# EAGLE design PowerSocket2 (EAGLE 8.2.1)
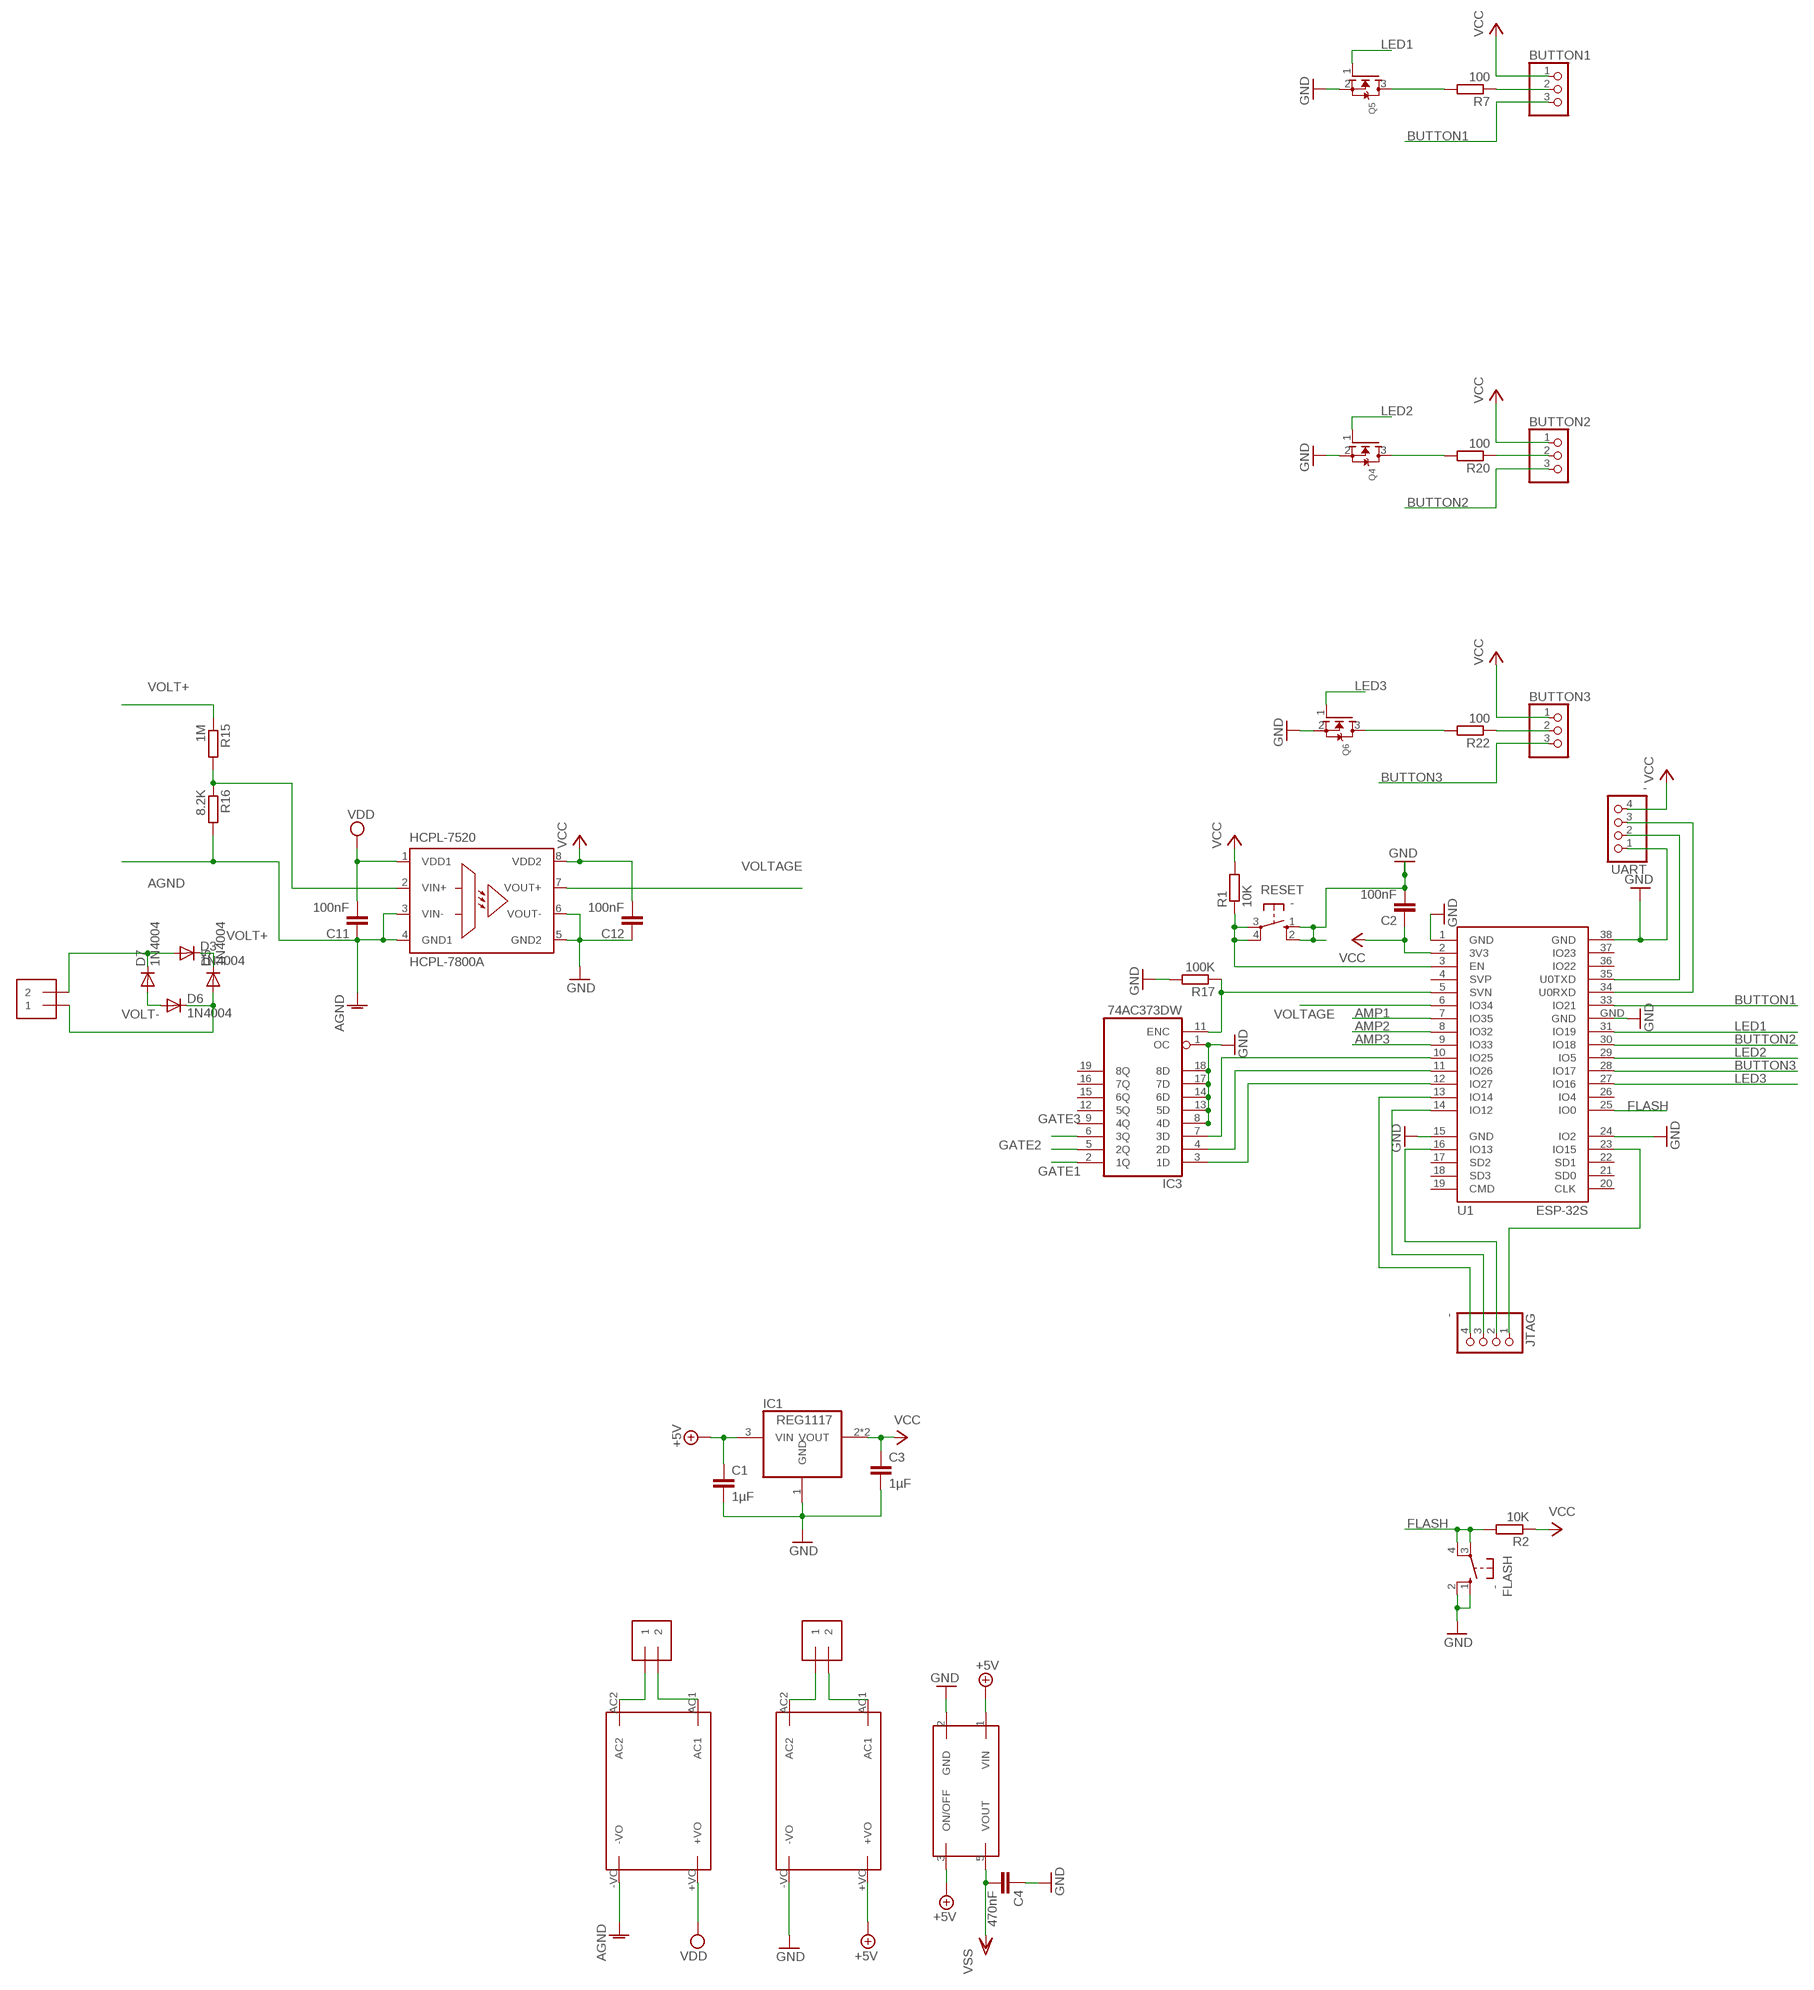
[diagram p0: schematic, sheet 1, part 1 of 2]
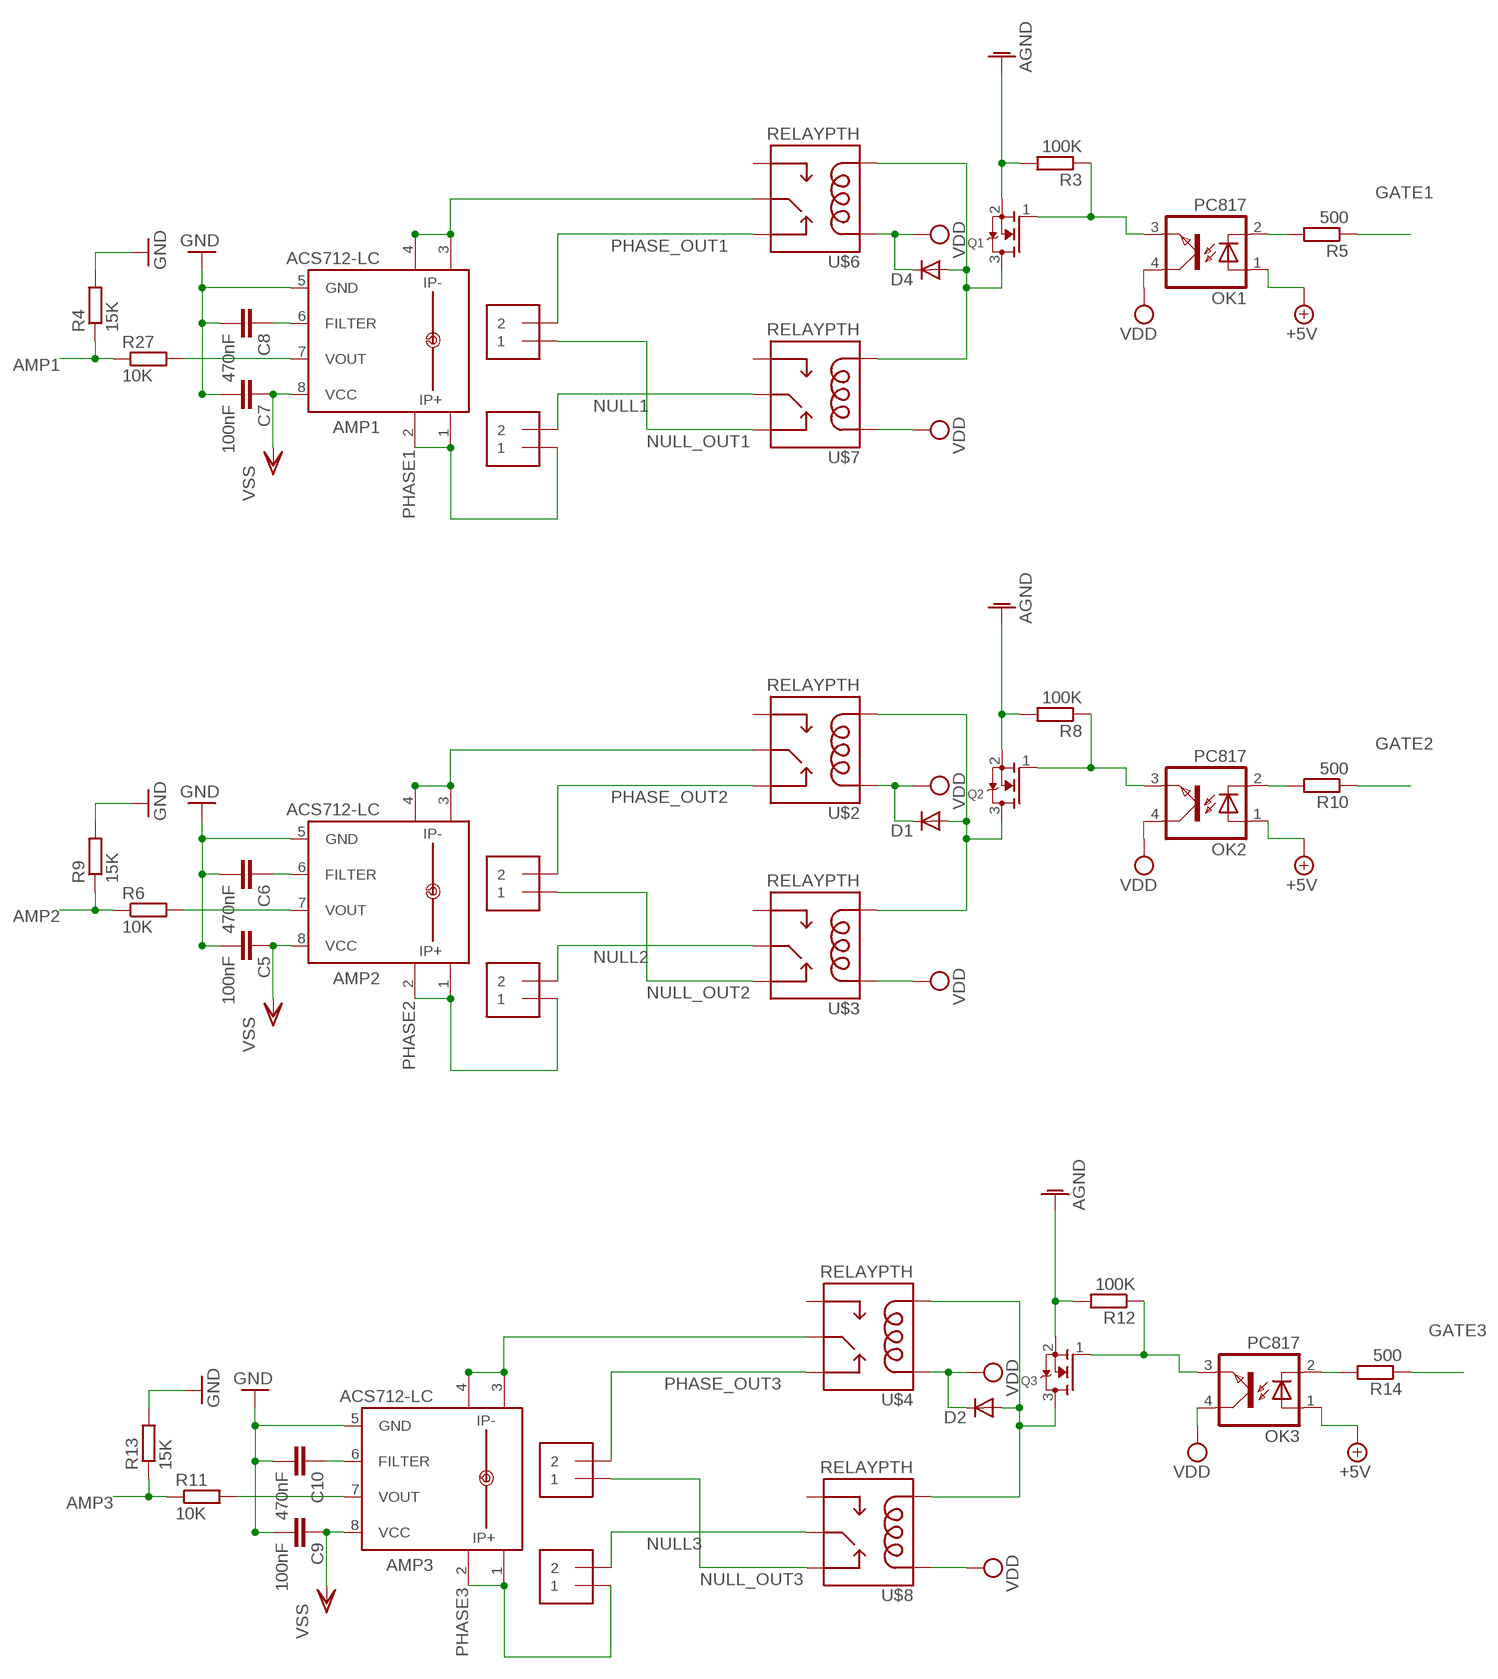
[diagram p1: schematic, sheet 1, part 2 of 2]

## Parts
4.5V_REG  S1112  [SOT23-5]
AMP1  ACS712-LC  [SOIC8]
AMP2  ACS712-LC  [SOIC8]
AMP3  ACS712-LC  [SOIC8]
BUTTON1  PINHD-1X3  [1X03]
BUTTON2  PINHD-1X3  [1X03]
BUTTON3  PINHD-1X3  [1X03]
C1  1µF  C-EU025-024X044  [C025-024X044]
C2  100nF  C-EUC1206  [C1206]
C3  1µF  C-EU025-024X044  [C025-024X044]
C4  470nF  C-EUC0805  [C0805]
C5  100nF  C-EUC0805  [C0805]
C6  470nF  C-EUC0805  [C0805]
C7  100nF  C-EUC0805  [C0805]
C8  470nF  C-EUC0805  [C0805]
C9  100nF  C-EUC0805  [C0805]
C10  470nF  C-EUC0805  [C0805]
C11  100nF  C-EUC1206  [C1206]
C12  100nF  C-EUC1206  [C1206]
D1  DIODE-DO-214AC  [DO-214AC]
D2  DIODE-DO-214AC  [DO-214AC]
D3  1N4004  [DO41-10]
D4  DIODE-DO-214AC  [DO-214AC]
D5  1N4004  [DO41-10]
D6  1N4004  [DO41-10]
D7  1N4004  [DO41-10]
FLASH  -  10-XX  [B3F-10XX]
HCPL-7520  HCPL-7800A  [DIP8]
IC1  REG1117  [SOT223]
IC3  74AC373DW  [SO20W]
J1  1X2-3.5MM  [1X2-3.5MM]
J2  1X2-3.5MM  [1X2-3.5MM]
J3  1X2-3.5MM  [1X2-3.5MM]
J4  1X2-3.5MM  [1X2-3.5MM]
J5  1X2-3.5MM  [1X2-3.5MM]
J6  1X2-3.5MM  [1X2-3.5MM]
J7  1X2-3.5MM  [1X2-3.5MM]
J8  1X2-3.5MM  [1X2-3.5MM]
J9  1X2-3.5MM  [1X2-3.5MM]
JTAG  -  PINHD-1X4  [1X04]
OK1  PC817  [DIL04]
OK2  PC817  [DIL04]
OK3  PC817  [DIL04]
Q1  MOSFET-NREFLOW  [SOT23]
Q2  MOSFET-NREFLOW  [SOT23]
Q3  MOSFET-NREFLOW  [SOT23]
Q4  MOSFET-NREFLOW  [SOT23]
Q5  MOSFET-NREFLOW  [SOT23]
Q6  MOSFET-NREFLOW  [SOT23]
R1  10K  R-EU_R0805  [R0805]
R2  10K  R-EU_R0805  [R0805]
R3  100K  R-EU_R0805  [R0805]
R4  15K  R-EU_R0805  [R0805]
R5  500  R-EU_R0805  [R0805]
R6  10K  R-EU_R0805  [R0805]
R7  100  R-EU_R0805  [R0805]
R8  100K  R-EU_R0805  [R0805]
R9  15K  R-EU_R0805  [R0805]
R10  500  R-EU_R0805  [R0805]
R11  10K  R-EU_R0805  [R0805]
R12  100K  R-EU_R0805  [R0805]
R13  15K  R-EU_R0805  [R0805]
R14  500  R-EU_R0805  [R0805]
R15  1M  R-EU_0207/10  [0207/10]
R16  8.2K  R-EU_0207/10  [0207/10]
R17  100K  R-EU_R0805  [R0805]
R20  100  R-EU_R0805  [R0805]
R22  100  R-EU_R0805  [R0805]
R27  10K  R-EU_R0805  [R0805]
RESET  -  10-XX  [B3F-10XX]
U1  ESP-32S  [ESP-32S]
U$1  HLK-PM03  [HLK-PM03]
U$2  RELAYPTH  [SRD-05VDC-SL-C]
U$3  RELAYPTH  [SRD-05VDC-SL-C]
U$4  RELAYPTH  [SRD-05VDC-SL-C]
U$5  HLK-PM03  [HLK-PM03]
U$6  RELAYPTH  [SRD-05VDC-SL-C]
U$7  RELAYPTH  [SRD-05VDC-SL-C]
U$8  RELAYPTH  [SRD-05VDC-SL-C]
UART  -  PINHD-1X4  [1X04]

## Nets
+5V: 4.5V_REG.1(VIN) 4.5V_REG.3(ON/OFF) C1.1 IC1.3(VIN) OK1.1(A) OK2.1(A) OK3.1(A) U$1.+VO
AGND: C11.1 HCPL-7520.3(VIN-) HCPL-7520.4(GND1) Q1.2(S) Q2.2(S) Q3.2(S) R3.2 R8.2 R12.2 R16.2 U$5.-VO
AMP1: R4.1 R27.1 U1.7(IO35)
AMP2: R6.1 R9.1 U1.8(IO32)
AMP3: R11.1 R13.1 U1.9(IO33)
BUTTON1: BUTTON1.3 U1.33(IO21)
BUTTON2: BUTTON2.3 U1.30(IO18)
BUTTON3: BUTTON3.3 U1.28(IO17)
FLASH: FLASH.3(P) FLASH.4(P1) R2.2 U1.25(IO0)
GATE: OK1.3(EMIT) Q1.1(G) R3.1
GATE1: IC3.2(1Q) R5.1
GATE2: IC3.5(2Q) R10.1
GATE3: IC3.6(3Q) R14.1
GATE4: OK2.3(EMIT) Q2.1(G) R8.1
GATE5: OK3.3(EMIT) Q3.1(G) R12.1
GND: 4.5V_REG.2(GND) AMP1.5(GND) AMP2.5(GND) AMP3.5(GND) C1.2 C2.2 C3.2 C4.1 C5.2 C6.2 C7.2 C8.2 C9.2 C10.2 C12.1 FLASH.1(S) FLASH.2(S1) HCPL-7520.5(GND2) HCPL-7520.6(VOUT-) IC1.1(GND) IC3.1(OC) IC3.8(4D) IC3.13(5D) IC3.14(6D) IC3.17(7D) IC3.18(8D) Q4.2(S) Q5.2(S) Q6.2(S) R4.2 R9.2 R13.2 R17.2 RESET.1(S) RESET.2(S1) U1.1(GND) U1.15(GND) U1.24(IO2) U1.38(GND) U1.GND U$1.-VO UART.1
LED1: Q5.1(G) U1.31(IO19)
LED1_SWITCHED: Q5.3(D) R7.2
LED2: Q4.1(G) U1.29(IO5)
LED2_SWITCHED: Q4.3(D) R20.2
LED3: Q6.1(G) U1.27(IO16)
LED3_SWITCHED: Q6.3(D) R22.2
N$1: D4.A Q1.3(D) U$6.COIL0 U$7.COIL0
N$2: JTAG.1 U1.23(IO15)
N$3: JTAG.2 U1.16(IO13)
N$4: JTAG.3 U1.14(IO12)
N$5: JTAG.4 U1.13(IO14)
N$6: J4.2 U$5.AC1
N$7: BUTTON2.2 R20.1
N$8: J4.1 U$5.AC2
N$9: BUTTON1.2 R7.1
N$10: OK1.2(C) R5.2
N$11: BUTTON3.2 R22.1
N$12: AMP2.6(FILTER) C6.1
N$13: AMP2.7(VOUT) R6.2
N$14: D1.A Q2.3(D) U$2.COIL0 U$3.COIL0
N$17: OK2.2(C) R10.2
N$19: AMP2.3(IP-) AMP2.4(IP-1) U$2.SWCOMMON
N$24: AMP1.6(FILTER) C8.1
N$26: AMP1.3(IP-) AMP1.4(IP-1) U$6.SWCOMMON
N$27: AMP3.6(FILTER) C10.1
N$28: AMP3.7(VOUT) R11.2
N$29: D2.A Q3.3(D) U$4.COIL0 U$8.COIL0
N$30: OK3.2(C) R14.2
N$31: AMP3.3(IP-) AMP3.4(IP-1) U$4.SWCOMMON
N$32: IC3.11(ENC) R17.1 U1.5(SVN)
N$33: IC3.3(1D) U1.12(IO27)
N$34: IC3.4(2D) U1.11(IO26)
N$35: IC3.7(3D) U1.10(IO25)
N$37: D3.A D7.C J9.2
N$38: D5.A D6.C J9.1
N$39: HCPL-7520.2(VIN+) R15.2 R16.1
N$41: AMP1.7(VOUT) R27.2
N$66: R1.1 RESET.3(P) RESET.4(P1) U1.3(EN)
N$70: U1.35(U0TXD) UART.2
N$77: U1.34(U0RXD) UART.3
NULL1: J2.2 U$7.SWCOMMON
NULL2: J6.2 U$3.SWCOMMON
NULL3: J8.2 U$8.SWCOMMON
NULL_MIC: J3.1 U$1.AC2
NULL_OUT1: J1.1 U$7.SWCLOSED(SWCLOSE)
NULL_OUT2: J5.1 U$3.SWCLOSED(SWCLOSE)
NULL_OUT3: J7.1 U$8.SWCLOSED(SWCLOSE)
PHASE1: AMP1.1(IP+) AMP1.2(IP+1) J2.1
PHASE2: AMP2.1(IP+) AMP2.2(IP+1) J6.1
PHASE3: AMP3.1(IP+) AMP3.2(IP+1) J8.1
PHASE_MIC: J3.2 U$1.AC1
PHASE_OUT1: J1.2 U$6.SWCLOSED(SWCLOSE)
PHASE_OUT2: J5.2 U$2.SWCLOSED(SWCLOSE)
PHASE_OUT3: J7.2 U$4.SWCLOSED(SWCLOSE)
VCC: BUTTON1.1 BUTTON2.1 BUTTON3.1 C2.1 C3.1 C12.2 HCPL-7520.8(VDD2) IC1.2(VOUT) IC1.4(VOUT) R1.2 R2.1 U1.2(3V3) UART.4
VDD: C11.2 D1.C D2.C D4.C HCPL-7520.1(VDD1) OK1.4(COL) OK2.4(COL) OK3.4(COL) U$2.COIL1 U$3.COIL1 U$4.COIL1 U$5.+VO U$6.COIL1 U$7.COIL1 U$8.COIL1
VOLT+: D3.C D5.C R15.1
VOLT-: D6.A D7.A
VOLTAGE: HCPL-7520.7(VOUT+) U1.6(IO34)
VSS: 4.5V_REG.5(VOUT) AMP1.8(VCC) AMP2.8(VCC) AMP3.8(VCC) C4.2 C5.1 C7.1 C9.1
Unconnected: IC3.9(4Q) IC3.12(5Q) IC3.15(6Q) IC3.16(7Q) IC3.19(8Q) U1.4(SVP) U1.17(SD2) U1.18(SD3) U1.19(CMD) U1.20(CLK) U1.21(SD0) U1.22(SD1) U1.26(IO4) U1.36(IO22) U1.37(IO23) U$2.SWOPEN U$3.SWOPEN U$4.SWOPEN U$6.SWOPEN U$7.SWOPEN U$8.SWOPEN

## Power pins joined to a net without a drawn wire
GND: IC3.10(GND)
VCC: IC3.20(VCC)

## Library data of the parts
4.5V_REG = PowerSocket:S1112
AMP1-AMP3 = allegro-2:ACS712-LC
BUTTON1-BUTTON3 = pinhead:PINHD-1X3: PIN HEADER
C1-C12 = rcl:C-EU: CAPACITOR, European symbol
D1 D2 D4 = diode:DIODE-: DIODE
D3 D5-D7 = diode@1:1N4004: DIODE general purpose rectifier, 1 A
FLASH RESET = switch-omron:10-XX: OMRON SWITCH; MPN: B3F-1000; OC_FARNELL: 176432; OC_NEWARK: 36M3542
HCPL-7520 = avago:HCPL-7800: Isolation Amplifer Source: http://www.avagotech.com/docs/AV02-0410EN; MF: AGILENT TECHNOLOGIES; MPN: HCPL-7800A-000E; OC_FARNELL: 8550026; OC_NEWARK: 88H7847
IC1 = burr-brown:REG1117: 800mA and 1A Low Dropout (LDO) Positive Regulator 1.8V, 2.5V, 2.85V, 3.3V, 5V, and Adj; MPN: REG1117; OC_FARNELL: 1097566; OC_NEWARK: 14P6981
IC3 = 74xx-eu:74*373: Octal D type transparent LATCH, edge triggered
J1-J9 = adafruit:1X2: 3.5mm Terminal block http://www.ladyada.net/library/pcb/eaglelibrary.html
JTAG UART = pinhead:PINHD-1X4: PIN HEADER
OK1-OK3 = optocoupler:PC817: SHARP OPTO COUPLER; MPN: PC817X4J000F; OC_FARNELL: 9707727; OC_NEWARK: 97K7059
Q1-Q6 = adafruit:MOSFET-N: N-Channel Mosfet 2N7002E - 60V 260mA SOT23 [Digikey: 2N7002ET1GOSTR-ND] - REEL BSH103 - 30V 850mA SOT23 [Digikey: 568-5013-1-ND]
R1-R14 R17 R20 R22 R27 = rcl:R-EU_: RESISTOR, European symbol
R15 R16 = resistor:R-EU_: RESISTOR, European symbol
U1 = esp32:ESP-32S: Ai-Thinker ESP-32S
U$1 U$5 = PowerSocket:HLK-PM03
U$2-U$4 U$6-U$8 = SRD-05VDC-SL-C:RELAY: SPDT relay (COM-00101)

## Board
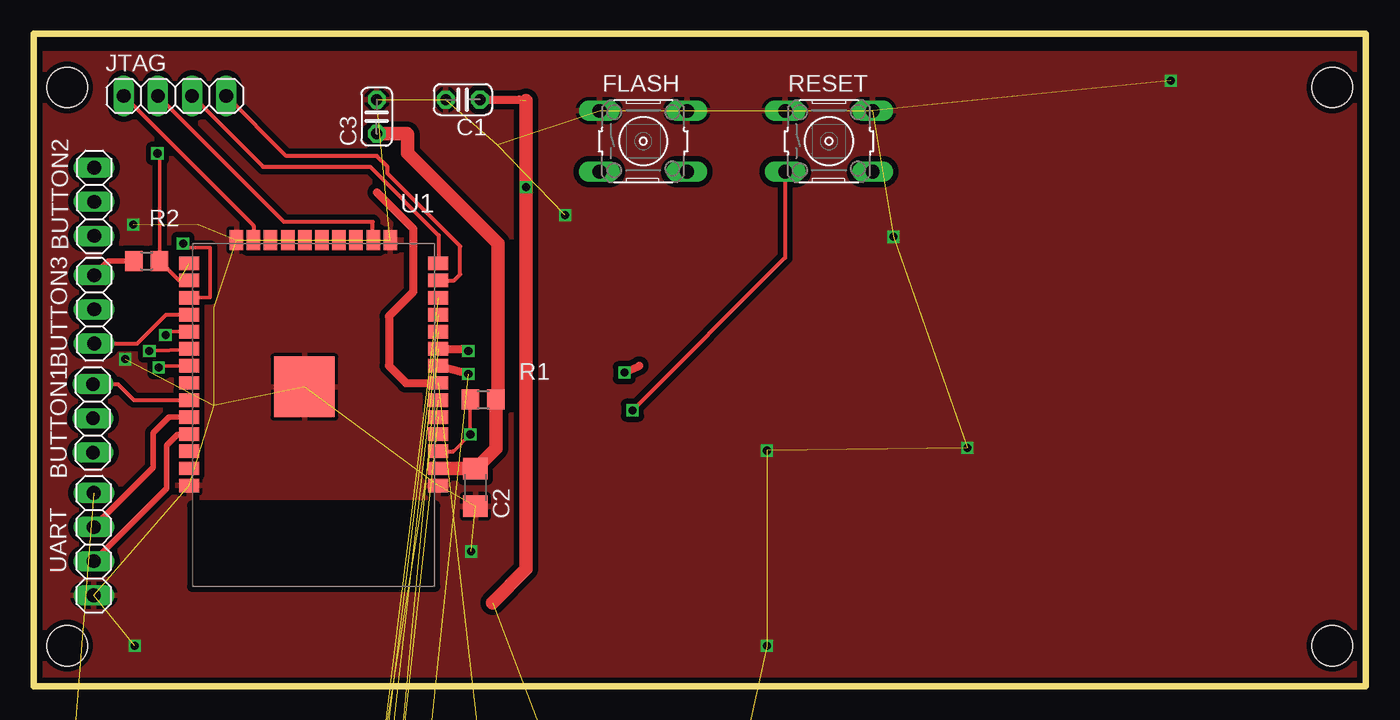
[diagram p2: board, top side]
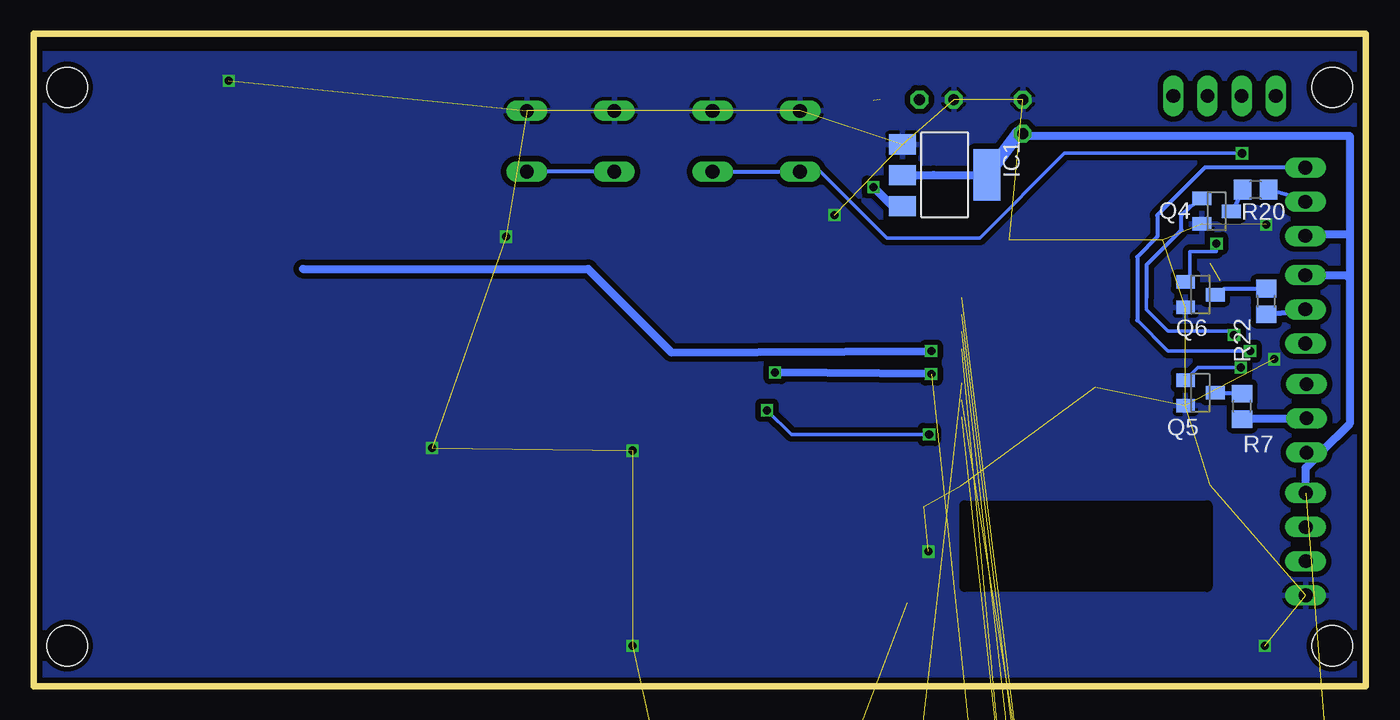
[diagram p3: board, bottom side, seen from below]

Size 99 x 48.5 mm. Coordinates in mm from the lower left corner, seen from the top.
Outline: 0,0 99,0 99,48.5 0,48.5 0,0
Copper layers (1*16): Top 0.035mm / dielectric 1.5mm / Bottom 0.035mm
Design rules "dirt_cheap_dirty_boards.v1": minimum track width 5mil, minimum drill 12mil, track to track 5mil, track to pad 5mil, pad to pad 5mil, via to via 5mil, smd to smd 0mil, copper to edge 10mil, drill to drill 10mil, minimum pad ring 10mil, minimum via ring 6mil, stop-mask expansion 2mil, vias tented up to drill 25mil, thermal gap 10mil
Holes 3 mm at 2.5,3 96.5,3 96.5,44.5 2.5,44.5

### Footprints (pad centres in the part's own frame; a part is rotated, then mirrored left to right if it is on the bottom)
SOT23-5 = smd 0.5 x 1: 1 -0.95,-1.2; 2 0,-1.2; 3 0.95,-1.2; 4 0.95,1.2; 5 -0.95,1.2
SOIC8 = smd 0.6 x 2.2: 1 -1.905,-2.6; 2 -0.635,-2.6; 3 0.635,-2.6; 4 1.905,-2.6; 5 1.905,2.6; 6 0.635,2.6; 7 -0.635,2.6; 8 -1.905,2.6
1X03 = drill 1.016 long: 1 -2.54,0; 2 0,0; 3 2.54,0
C025-024X044 = drill 0.813 octagon: 1 -1.27,0; 2 1.27,0
C1206 = smd 1.6 x 1.8: 1 -1.4,0; 2 1.4,0
C0805 = smd 1.3 x 1.5: 1 -0.95,0; 2 0.95,0
DO-214AC = smd 1.8 x 2.4: A 2.025,0; C -2.025,0
DO41-10 = drill 1.118: A 5.08,0; C -5.08,0
B3F-10XX = drill 1.016 long: 1 -3.251,2.261; 2 3.251,2.261; 3 -3.251,-2.261; 4 3.251,-2.261
DIP8 = smd 1.16 x 2: 1 -3.81,-4.45; 4 3.81,-4.45; 5 3.81,4.45; 8 -3.81,4.45 | smd 1.27 x 2: 2 -1.27,-4.45; 3 1.27,-4.45; 6 1.27,4.45; 7 -1.27,4.45
SOT223 = smd 1.499 x 2.007: 1 -2.261,-3.15; 2 0.025,-3.15; 3 2.311,-3.15 | smd 3.81 x 2.007: 4 0,3.15
SO20W = smd 0.66 x 2.032: 1 -5.715,-5.029; 2 -4.445,-5.029; 3 -3.175,-5.029; 4 -1.905,-5.029; 5 -0.635,-5.029; 6 0.635,-5.029; 7 1.905,-5.029; 8 3.175,-5.029; 9 4.445,-5.029; 10 5.715,-5.029; 11 5.715,5.029; 12 4.445,5.029; 13 3.175,5.029; 14 1.905,5.029; 15 0.635,5.029; 16 -0.635,5.029; 17 -1.905,5.029; 18 -3.175,5.029; 19 -4.445,5.029; 20 -5.715,5.029
1X2-3.5MM = drill 1 pad 2.184: 1 1.8,0; 2 -1.7,0
1X04 = drill 1.016 long: 1 -3.81,0; 2 -1.27,0; 3 1.27,0; 4 3.81,0
DIL04 = drill 0.813 offset: 1 -1.27,-3.81; 2 1.27,-3.81; 3 1.27,3.81; 4 -1.27,3.81
SOT23 = smd 1 x 1.4: 1 -0.95,-1.1; 2 0.95,-1.1; 3 0,1.1
R0805 = smd 1.3 x 1.5: 1 -0.95,0; 2 0.95,0
0207/10 = drill 0.813 octagon: 1 -5.08,0; 2 5.08,0
ESP-32S = smd 1.5 x 1: 1 -9.25,7; 2 -9.25,5.73; 3 -9.25,4.46; 4 -9.25,3.19; 5 -9.25,1.92; 6 -9.25,0.65; 7 -9.25,-0.62; 8 -9.25,-1.89; 9 -9.25,-3.16; 10 -9.25,-4.43; 11 -9.25,-5.7; 12 -9.25,-6.97; 13 -9.25,-8.24; 14 -9.25,-9.51; 25 9.25,-9.51; 26 9.25,-8.24; 27 9.25,-6.97; 28 9.25,-5.7; 29 9.25,-4.43; 30 9.25,-3.16; 31 9.25,-1.89; 32 9.25,-0.62; 33 9.25,0.65; 34 9.25,1.92; 35 9.25,3.19; 36 9.25,4.46; 37 9.25,5.73; 38 9.25,7 | smd 1 x 1.5: 15 -5.7,-11.25; 16 -4.43,-11.25; 17 -3.16,-11.25; 18 -1.89,-11.25; 19 -0.62,-11.25; 20 0.65,-11.25; 21 1.92,-11.25; 22 3.19,-11.25; 23 4.46,-11.25; 24 5.73,-11.25 | smd 4.5 x 4.5: GND 0.68,-0.33
HLK-PM03 = drill 1.4 pad 3.81 square: +VO 29.4,10.2; -VO 29.4,-5.2; AC1 0,5.08; AC2 0,0
SRD-05VDC-SL-C = drill 0.9: COIL0 -5.39,-6.12; COIL1 -5.39,5.88; SWCLOSED 6.61,-6.12; SWCOMMON -7.39,-0.12; SWOPEN 6.61,5.88

### Placement (x,y rotation side)
4.5V_REG  15.2,-178.2 0 top  (outside the outline)
AMP1  49.6,-167.3 0 top  (outside the outline)
AMP2  1.2,-338.6 0 top  (outside the outline)
AMP3  1.2,-413.5 0 top  (outside the outline)
BUTTON1  4.4,19.9 90 top
BUTTON2  4.5,36 90 top
BUTTON3  4.5,28 270 top
C1  31.9,43.6 180 top
C2  32.83,14.76 270 top
C3  25.5,42.33 90 top
C4  28.4,-177.5 0 top  (outside the outline)
C5  17.6,-333.5 0 top  (outside the outline)
C6  24,-333.5 0 top  (outside the outline)
C7  34.8,-177.5 0 top  (outside the outline)
C8  41.2,-177.5 0 top  (outside the outline)
C9  17.6,-408.4 0 top  (outside the outline)
C10  24,-408.4 0 top  (outside the outline)
C11  -46.4,-452.1 0 top  (outside the outline)
C12  -46.4,-573.9 0 top  (outside the outline)
D1  8.7,-334.6 0 top  (outside the outline)
D2  8.7,-409.5 0 top  (outside the outline)
D3  -35.4,-485.5 0 top  (outside the outline)
D4  9.8,-178.6 0 top  (outside the outline)
D5  -35.4,-502.3 0 top  (outside the outline)
D6  -35.4,-519.1 0 top  (outside the outline)
D7  -35.4,-535.9 0 top  (outside the outline)
FLASH  45.3,40.5 0 top
HCPL-7520  -41.6,-441.2 0 top  (outside the outline)
IC1  31.3,38 270 bottom
IC3  -25.6,-440.7 0 top  (outside the outline)
J1  9.5,-221.8 0 top  (outside the outline)
J2  9.5,-243.7 0 top  (outside the outline)
J3  9.5,-193.9 0 top  (outside the outline)
J4  9.5,-265.6 0 top  (outside the outline)
J5  -6.3,-319.6 0 top  (outside the outline)
J6  19.1,-319.6 0 top  (outside the outline)
J7  -6.3,-394.5 0 top  (outside the outline)
J8  19.1,-394.5 0 top  (outside the outline)
J9  -36.3,-466.1 0 top  (outside the outline)
JTAG  10.5,43.87 0 top
OK1  -11.1,-266.1 0 top  (outside the outline)
OK2  -11.1,-341 0 top  (outside the outline)
OK3  -11.1,-415.9 0 top  (outside the outline)
Q1  24.9,-178.2 0 top  (outside the outline)
Q2  14.1,-334.2 0 top  (outside the outline)
Q3  14.1,-409.1 0 top  (outside the outline)
Q4  11.1,35.3 270 bottom
Q5  12.3,21.8 270 bottom
Q6  12.3,29.1 270 bottom
R1  33.4,21.3 0 top
R2  8.4,31.6 0 top
R3  47.6,-177.5 0 top  (outside the outline)
R4  -1.2,-207.8 0 top  (outside the outline)
R5  -16.9,-279.5 0 top  (outside the outline)
R6  -11.7,-354.4 0 top  (outside the outline)
R7  9.2,20.8 90 bottom
R8  30.4,-333.5 0 top  (outside the outline)
R9  -6.6,-354.4 0 top  (outside the outline)
R10  -16.9,-354.4 0 top  (outside the outline)
R11  -16.9,-429.3 0 top  (outside the outline)
R12  30.4,-408.4 0 top  (outside the outline)
R13  -11.7,-429.3 0 top  (outside the outline)
R14  -6.5,-429.3 0 top  (outside the outline)
R15  -37.2,-550.9 0 top  (outside the outline)
R16  -37.2,-564.2 0 top  (outside the outline)
R17  -46.9,-580 0 top  (outside the outline)
R20  8.2,36.9 180 bottom
R22  7.4,28.6 90 bottom
R27  53.7,-177.5 0 top  (outside the outline)
RESET  59.1,40.5 0 top
U1  20.8,21.91 180 top
U$1  15.9,-33.5 0 top  (outside the outline)
U$2  -4.5,-295.5 0 top  (outside the outline)
U$3  23.6,-295.5 0 top  (outside the outline)
U$4  -4.5,-370.4 0 top  (outside the outline)
U$5  15.9,-87 0 top  (outside the outline)
U$6  11.3,-124.2 0 top  (outside the outline)
U$7  39.4,-124.2 0 top  (outside the outline)
U$8  23.6,-370.4 0 top  (outside the outline)
UART  4.47,10.55 90 top

### Tracks (layer width: path | path; a pad name or v marks a point on that pad's centre or on a via)
+5V  (via drill 0.6)  (7 unrouted)
  Top 0.61: C1.1 36.1,43.6
  Top 1.016: 34.1,6.2 36.6,8.7 v36.6,37.1 36.6,43.5
  Bottom 0.61: IC1.3 34.69,35.59 35.09,35.59 v36.6,37.1
AGND  (10 unrouted)
AMP1  (2 unrouted)
  Top 0.61: U1.7 27.67,22.53 26.4,23.8 26.4,27.5 28.2,29.3 28.2,34 25.5,36.7
AMP2  (via drill 0.6)  (2 unrouted)
  Top 0.61: v32.3,23.2 U1.8 | v43.9,23.3 45,23.8
  Bottom 0.61: v32.3,23.2 v43.9,23.3
AMP3  (via drill 0.6)  (2 unrouted)
  Top 0.61: U1.9 31.87,25.07 v32.3,24.9
  Bottom 0.61: 79,31 57.8,31 51.6,24.8 v32.3,24.9
BUTTON1
  Top 0.305: 11.49,21.2 U1.33 7.44,21.26 6.26,22.44 BUTTON1.3
BUTTON2  (via drill 0.6)
  Top 0.305: U1.30 11.62,25 v8.6,24.9
  Bottom 0.254: 17,27.2 14.7,24.9 v8.6,24.9
  Bottom 0.305: 17,27.2 17,31.9 15.5,33.4 15.5,35 11.96,38.54 BUTTON2.3
BUTTON3
  Top 0.305: U1.28 9.84,27.61 7.69,25.46 6.51,25.46 BUTTON3.3
FLASH  (via drill 0.6)  (1 unrouted)
  Top 0.254: v9.2,39.6 9.35,39.45 R2.2
  Top 0.305: R2.2 10.8,30.15
  Bottom 0.254: FLASH.3 40.54,38.24 35.6,33.3 28.7,33.3 22.4,39.6 v9.2,39.6
  Bottom 0.305: FLASH.4 FLASH.3
GATE  (2 unrouted)
GATE1  (1 unrouted)
GATE2  (1 unrouted)
GATE3  (1 unrouted)
GATE4  (2 unrouted)
GATE5  (2 unrouted)
GND  (via drill 0.6)  (52 unrouted)
  other vias: 7.4,34.3 7.5,3 54.5,3 54.5,17.5 69.4,17.7 39.5,35 84.5,45 32.5,10 63.9,33.4 6.8,24.3
  pour Top (isolate 0.406): 0,47 0,0.5 99,0.5 99,47
  pour Bottom (isolate 0.406): 0,0.5 99,0.5 99,8.8 98.9,26.3 98.9,47 0,47
LED1  (via drill 0.6)
  Top 0.254: v9.3,23.68 9.42,23.8 12,23.8
  Top 0.305: U1.31 12,23.8
  Bottom 0.254: v9.3,23.68 12.47,23.68 Q5.1
LED1_SWITCHED
  Bottom 0.305: Q5.3 9.25,21.8 R7.2
LED2  (via drill 0.6)
  Top 0.254: U1.29 10.04,26.34 v9.8,26.1
  Bottom 0.254: 16.3,28.9 16.3,28 14.7,26.4 10.1,26.4 v9.8,26.1
  Bottom 0.305: 16.3,28.9 16.3,31.3 13.7,33.9 13.7,35 13.05,35.65 Q4.1
LED2_SWITCHED
  Bottom 0.305: Q4.3 9.85,35.35 R20.2
LED3  (via drill 0.6)
  Top 0.254: U1.27 13.1,28.88 13.1,32.6 11.1,32.6 v11.1,32.9
  Bottom 0.254: Q6.1 13.1,30.05 13.1,32.3 11.1,32.3 v11.1,32.9
  Bottom 0.305: 13.55,30.2 Q6.1
LED3_SWITCHED
  Bottom 0.305: Q6.3 10.55,29.55 R22.2
N$1  (3 unrouted)
N$2
  Top 0.305: JTAG.1 16.34,34.22 U1.23
N$3
  Top 0.305: U1.16 25.19,34.5 18.6,34.5 JTAG.2
N$4
  Top 0.305: JTAG.3 17.04,38.6 25,38.6 30.1,33.5 30.1,31.47 U1.14
N$5
  Top 0.305: U1.13 31.25,30.15 31.7,30.6 31.7,32.7 26.3,38.1 26.3,38.6 25.5,39.4 18.78,39.4 JTAG.4
N$6  (1 unrouted)
N$7
  Bottom 0.305: BUTTON2.2 5.95,36.55 R20.1
N$8  (1 unrouted)
N$9
  Bottom 0.61: R7.1 4.45,19.85 BUTTON1.2
N$10  (1 unrouted)
N$11
  Bottom 0.406: R22.1 4.65,27.85 BUTTON3.2
N$12  (1 unrouted)
N$13  (1 unrouted)
N$14  (3 unrouted)
N$17  (1 unrouted)
N$19  (2 unrouted)
N$24  (1 unrouted)
N$26  (2 unrouted)
N$27  (1 unrouted)
N$28  (1 unrouted)
N$29  (3 unrouted)
N$30  (1 unrouted)
N$31  (2 unrouted)
N$32  (2 unrouted)
N$33  (1 unrouted)
N$34  (1 unrouted)
N$35  (1 unrouted)
N$37  (2 unrouted)
N$38  (2 unrouted)
N$39  (2 unrouted)
N$41  (1 unrouted)
N$66  (via drill 0.6)
  Top 0.254: 31.2,17.45 v32.45,18.7 R1.1
  Top 0.305: U1.3 31.2,17.45 | RESET.3 55.85,31.85 v44.5,20.5
  Bottom 0.254: v44.5,20.5 42.7,18.7 v32.45,18.7
  Bottom 0.305: RESET.3 RESET.4
N$70
  Top 0.406: UART.2 9.9,14.71 9.9,17.9 10.72,18.72 U1.35
N$77
  Top 0.406: UART.3 8.9,16.25 8.9,18.8 10.09,19.99 U1.34
NULL1  (1 unrouted)
NULL2  (1 unrouted)
NULL3  (1 unrouted)
NULL_MIC  (1 unrouted)
NULL_OUT1  (1 unrouted)
NULL_OUT2  (1 unrouted)
NULL_OUT3  (1 unrouted)
PHASE1  (2 unrouted)
PHASE2  (2 unrouted)
PHASE3  (2 unrouted)
PHASE_MIC  (1 unrouted)
PHASE_OUT1  (1 unrouted)
PHASE_OUT2  (1 unrouted)
PHASE_OUT3  (1 unrouted)
VCC  (3 unrouted)
  Top 0.406: R2.1 5.56,31.6 BUTTON3.1
  Top 0.61: R1.2 34.5,18.85 | 32.81,16.18 C2.1 | 27.8,41 27.74,41.06
  Top 1.016: C2.1 34.35,17.68 R1.2 34.5,21.45 34.5,32.9 27.8,39.6 27.8,41 | U1.2 32.81,16.18 | 27.74,41.06 C3.1
  Bottom 0.61: 1.2,33.6 1.2,40.9 25.34,40.9 C3.1 25.85,41.06 | 1.2,33.6 1.2,30.3 | 1.2,30.3 1.2,19.5 3.3,17.4 | 3.3,17.4 4.47,16.23 UART.4 | BUTTON2.1 4.36,33.6 1.2,33.6 | BUTTON1.1 4.36,17.4 3.3,17.4 | BUTTON3.1 1.44,30.54 1.2,30.3 | IC1.2 32.12,38 IC1.4
  Bottom 1.016: 25.85,41.06 IC1.4
VDD  (14 unrouted)
VOLT+  (2 unrouted)
VOLT-  (1 unrouted)
VOLTAGE  (1 unrouted)
VSS  (7 unrouted)